# Altium schematic sheet Power Motor_Drive.SchDoc
size B
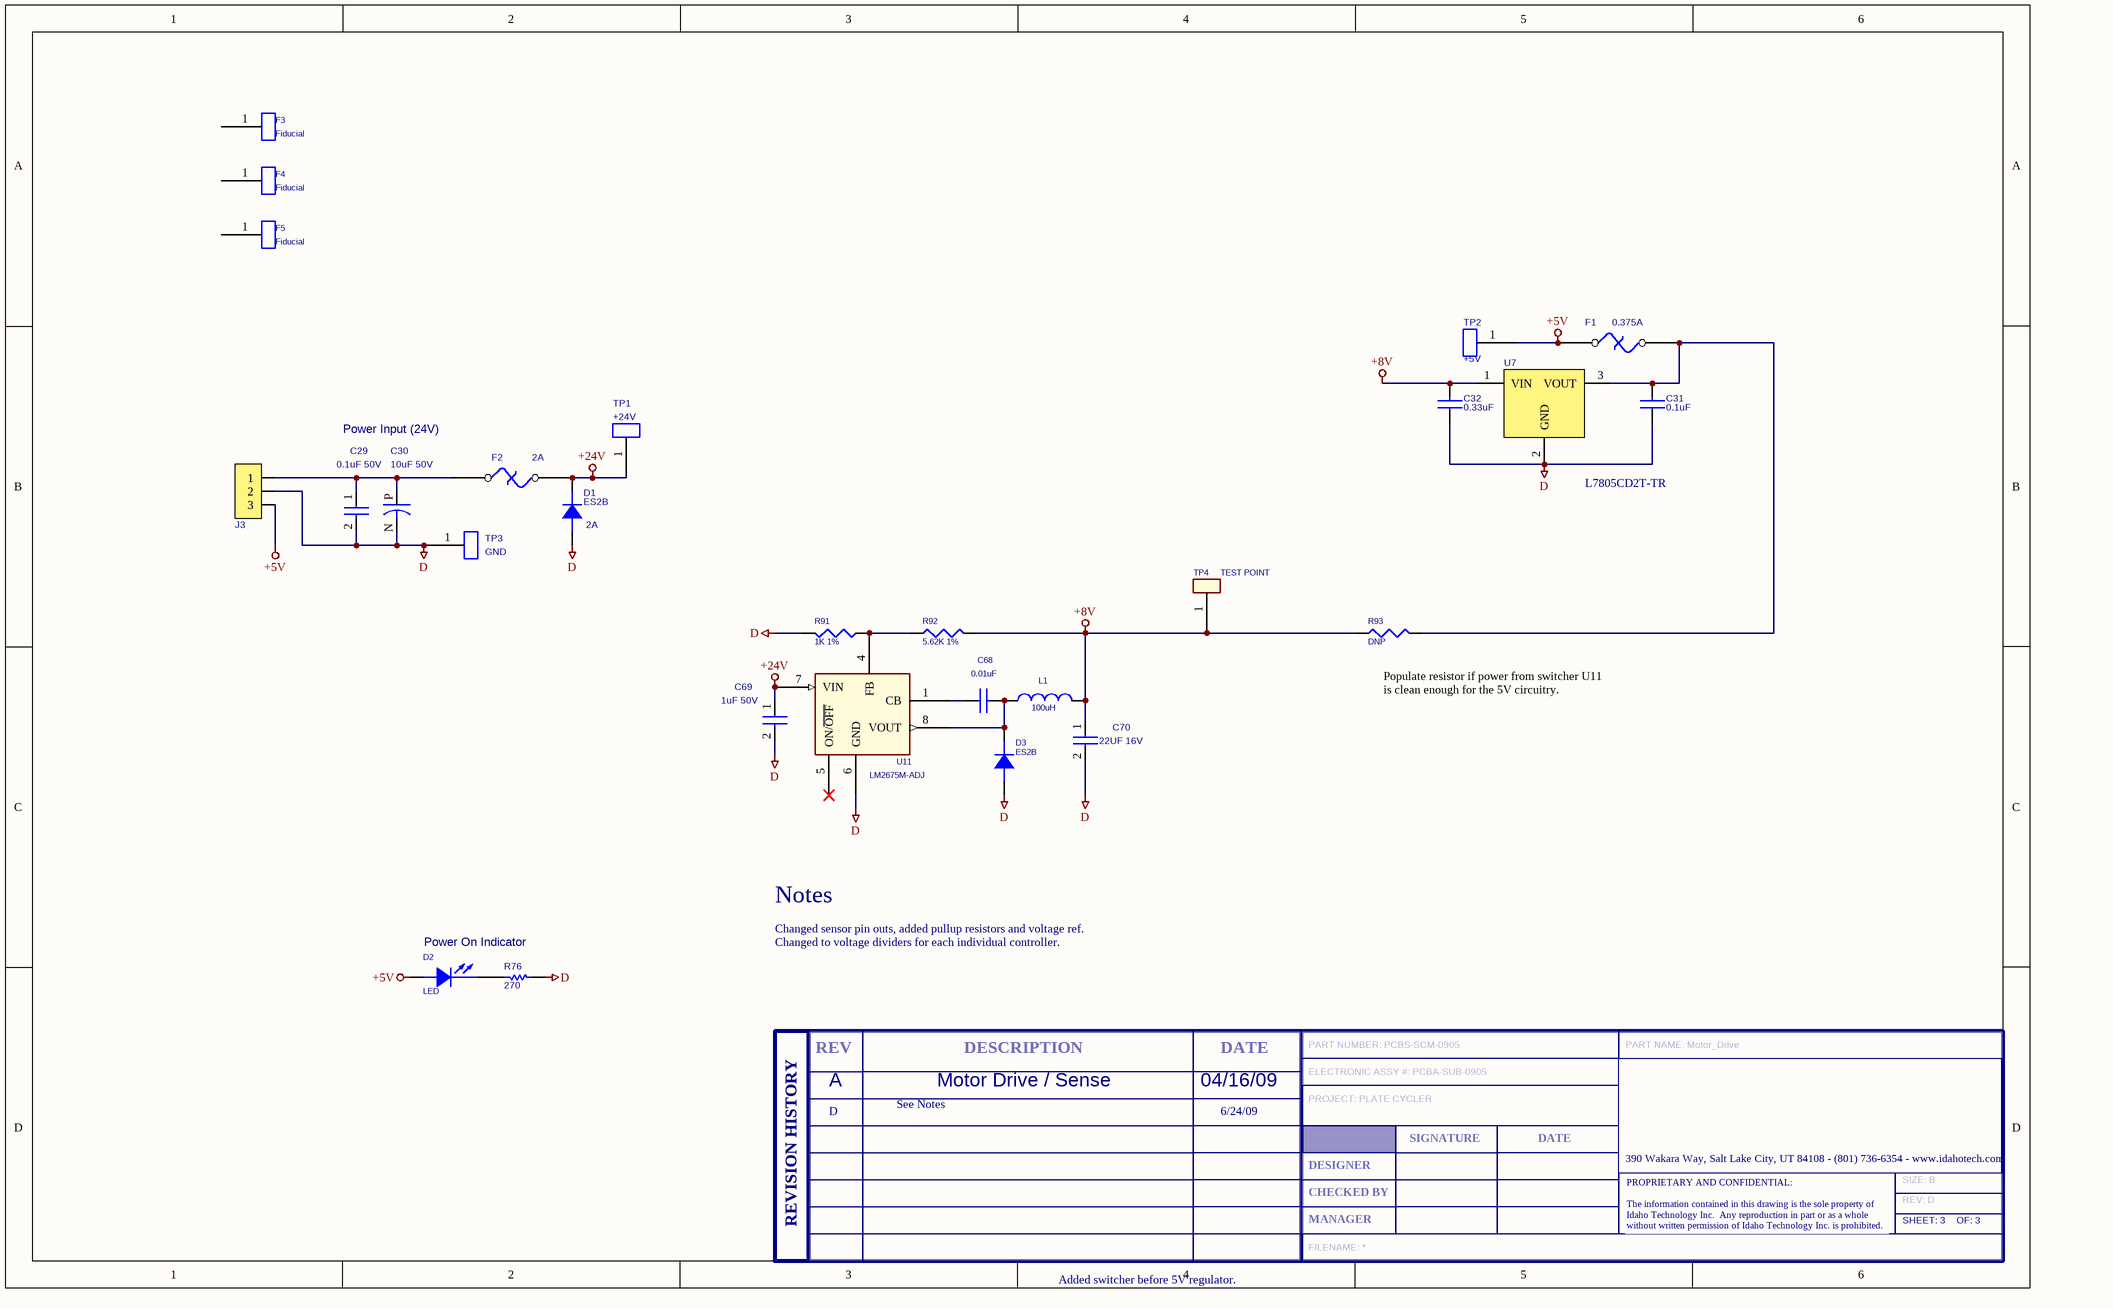
[diagram p0: Power Motor_Drive.SchDoc]

## Parts
C29  0.1uF 50V  [EIA 3216-18]
C30  10uF 50V  [SM/CT 7343]
C31  0.1uF  [SM/C_0603]
C32  0.33uF  [0805]
C68  0.01uF  [SM/C_0603]
C69  1uF 50V  [3225[1210]]
C70  22UF 16V  [1812]
D1  ES2B  value 2A  [SM/DO214AA_21]
D2  LED  [SM/D_0603]
D3  ES2B  [SM/DO214AA_21]
F1  0.375A  [SMD - Fuse]
F2  2A  [SMD - Fuse]
F3  Fiducial  [FIDUCAL]  (no BOM)
F4  Fiducial  [FIDUCAL]  (no BOM)
F5  Fiducial  [FIDUCAL]  (no BOM)
J3  HEADER_3X1_1  [MOLEX3]  (value not drawn)
L1  100uH  [L/12.3MMX12.3MM/PAD_5MM]
R76  value 270  [0603]  (hidden comment: Res1)
R91  1K 1%  [SM/R_0603]
R92  5.62K 1%  [SM/R_0603]
R93  DNP  [3216[1206]]  (no BOM)
T??  SIZE: B  REV: D  PART NUMBER: PCBS-SCM-0905  PART NAME: Motor_Drive  ELECTRONIC ASSY #: PCBA-SUB-0905  PROJECT: PLATE CYCLER  SHEET: 3  (hidden comment: ITI Title Block, A Size)  (graphical)
TP1  +24V  [TEST_POINT_1]
TP2  +5V  [TEST_POINT_1]
TP3  GND  [TEST_POINT_1]
TP4  TEST POINT  [BLKCON.100/VH/TM1SQ/W.100/1]
U7  Manufacturer P/N: L7805CD2T-TR  [D2Pak 5V reg]  (hidden comment: REGULATOR_24V_5V)
U11  LM2675M-ADJ  [SOG.050/8/WG.244/L.200]

## Nets
+5V: D2.1(ANODE) F1.1 J3.3 TP2.1
+8V: C32.2 C70.1 L1.2 R92.2 R93.1 TP4.1 U7.1(VIN)
+24V: C69.1 D1.2(K) F2.2 TP1.1 U11.7(VIN)
D: C29.2 C30.N C31.1 C32.1 C69.2 C70.2 D1.1(A) D3.1(A) J3.2 R76.1 R91.2 TP3.1 U7.2(GND) U11.6(GND)
NetC29_1: C29.1 C30.P F2.1 J3.1
NetC31_2: C31.2 F1.2 R93.2 U7.3(VOUT)
NetC68_1: C68.1 U11.1(CB)
NetC68_2: C68.2 D3.2(K) L1.1 U11.8(VOUT)
NetD2_2: D2.2(CATHODE) R76.2
NetR91_1: R91.1 R92.1 U11.4(FB)

Not connected (* = marked no-connect by the designer): F3 1; F4 1; F5 1; U11 5(ON/~{OFF})*

## Notes on the sheet
- Power Input (24V)
- (near R93) Populate resistor if power from switcher U11
  is clean enough for the 5V circuitry.
- Notes
- Power On Indicator
- (near T??) Changed sensor pin outs, added pullup resistors and voltage ref.
- (near T??) Changed to voltage dividers for each individual controller.
- A
- See Notes
- Motor Drive / Sense
- 04/16/09
- D
- 6/24/09
- Added switcher before 5V regulator.
- (in symbol ITI A-size Title Block and Rev Table) REV; DESCRIPTION; DATE; SIGNATURE; 390 Wakara Way, Salt Lake City, UT 84108 - (801) 736-6354 - www.idahotech.com; DESIGNER; CHECKED BY; REVISION HISTORY; MANAGER; PROPRIETARY AND CONFIDENTIAL: / The information contained in this drawing is the sole property of / Idaho Technology Inc.  Any reproduction in part or as a whole / without written permission of Idaho Technology Inc. is prohibited.

## Library data of the parts
C29 = CAP NP_1: CAP .1UF 50V CERM CHIP 1206 X7R; Manufacturer: PANASONIC; Manufacturer P/N: ECJ-3VB1H104K; Vendor P/N: PCC104BCT-ND; Vendor: DIGIKEY
C30 = CAP_1: CAP TANTALUM 10UF 50V 20% SMD; Manufacturer: KEMET; Manufacturer P/N: B45196H7106M509; Vendor P/N: 495-2288-1-ND; Vendor: DIGIKEY
C31 = CAP NP_Dup1: CAP CER .10UF 50V X7R 0603; Manufacturer: Taiyo Yuden; Manufacturer P/N: UMK107B7104KA-T; Vendor: Digikey; Vendor P/N: 587-1243-1-ND
C32 = CAP NP_Dup1: CAP CER .33UF 50V X7R 0805; Manufacturer: MURATA ELECTRONICS; Manufacturer P/N: GRM219R71H334KA88D; Vendor: Digikey; Vendor P/N: 490-3327-1-ND
C68 = CAP NP_Dup1: CAP 10000PF 50V CERM X7R 0603; Manufacturer: Panasonic; Manufacturer P/N: ECJ-1VB1H103K; Vendor: Digikey; Vendor P/N: PCC1784CT-ND
C69 = CAP NP_1: CAP 1.0UF 50V CERAMIC X7R 1210; Manufacturer P/N: C1210C105K5RACTU; Manufacturer: Kemet; Vendor P/N: 399-3076-1-ND; Vendor: DIGIKEY
C70 = CAP NP_1: CAP CER 22UF 16V X7R 20% 1812; Manufacturer P/N: C1210C105K5RACTU; Manufacturer: TDK; Vendor P/N: 445-1442-1-ND; Vendor: DIGIKEY
D1 D3 = DIODE: DIODE SUPER FAST REC 2A 100V SMB; Manufacturer: Diodes Inc.; Manufacturer P/N: ES2B-13-F; Vendor: Digikey; Vendor P/N: ES2B-FDICT-ND
D2 = LED: LED 565NM GRN DIFF 0603 SMD; Manufacturer: Lumex Opto/Components Inc; Manufacturer P/N: SML-LX0603GW-TR; Vendor: Digikey; Vendor P/N: 67-1549-1-ND
F1 = FUSE THERMAL: FUSEBLOCK W/.375A FUSE SMD FST; Manufacturer: Littelfuse Inc; Manufacturer P/N: 0154.375DR; Vendor P/N: F3150CT-ND; Vendor: Digikey
F2 = FUSE THERMAL: FUSEBLOCK W/2A FUSE SMD FAST; Manufacturer: Littelfuse Inc; Manufacturer P/N: 0154002.DR; Vendor P/N: F1224CT-ND; Vendor: Digikey
F3 F4 = TEST POINT: Description: TEST POINT PC MINI .040"D RED
F5 = TEST POINT: Description: TEST POINT PC MINI .040"D BLACK
J3 = HEADER_3X1_1: CONN HEADER 3POS .100 VERT GOLD; Manufacturer: MOLEX; Manufacturer P/N: 70543-0002; VENDOR: DIGIKEY; Vendor P/N: WM4801-ND; Price: 1.14
L1 = INDUCTOR: POWER INDUCTOR 100UH 1.3A SMD; Manufacturer P/N: CDRH125NP-101MC; Manufacturer: Sumida Corporation; Vendor P/N: 308-1437-1-ND; Vendor: Digikey
R76 = Res1: RES 270 OHM 1/10W 5% 0603 SMD; Manufacturer: Panasonic; Manufacturer P/N: ERJ-3GEYJ271V; Vendor: DIGIKEY; Vendor P/N: P270GCT-ND; IT P/N: N/A; Price: 0.71
R91 = RESISTOR/SM: RES 1.00K OHM 1/10W 1% 0603 SMD; Manufacturer P/N: ERJ-3EKF1001V; Manufacturer: Panasonic; Vendor: Digikey; Vendor P/N: P1.00KHCT-ND
R92 = RESISTOR/SM: RES 5.62K OHM 1/10W 1% 0603 SMD; Manufacturer P/N: ERJ-3EKF5621V; Manufacturer: Panasonic; Vendor: Digikey; Vendor P/N: P5.62KHCT-ND
R93 = RESISTOR/SM
T?? = ITI A-size Title Block and Rev Table: ITI Title Block and Rev Table, A Size; FILENAME: *; OF: 3
TP1 TP2 = TEST POINT: TEST POINT PC MINI .040"D RE; Manufacturer: KEYSTONE ELECTRONICS; Manufacturer P/N: 5000; Vendor P/N: 5000K-ND; Vendor: DIGIEKY
TP3 = TEST POINT: TEST POINT PC MINI .040"D BLACK; Manufacturer: KEYSTONE ELECTRONICS; Manufacturer P/N: 5001; Vendor P/N: 5001K-ND; Vendor: DIGIKEY; Price: 0.32
TP4 = TEST POINT: TEST POINT PC MINI .040"D RE; Manufacturer: Keystone Electronics; Manufacturer P/N: 5000; Vendor: Digikey; Vendor P/N: 5000K-ND
U7 = REGULATOR_24V_5V: IC REGULATOR POS 5V D2PAK; Manufacturer: STMicroelectronics; Vendor: DIGIKEY; Vendor P/N: 497-1171-1-ND; Price: .90
U11 = LM2675/SO_0: IC REG SIMPLE SWITCHER 8-SOIC; Manufacturer P/N: LM2675M-ADJ/NOPB; Manufacturer: National Semiconductor; Vendor P/N: LM2675M-ADJ-ND; Vendor: Digikey